# EAGLE design easy_001 (EAGLE 6.1)
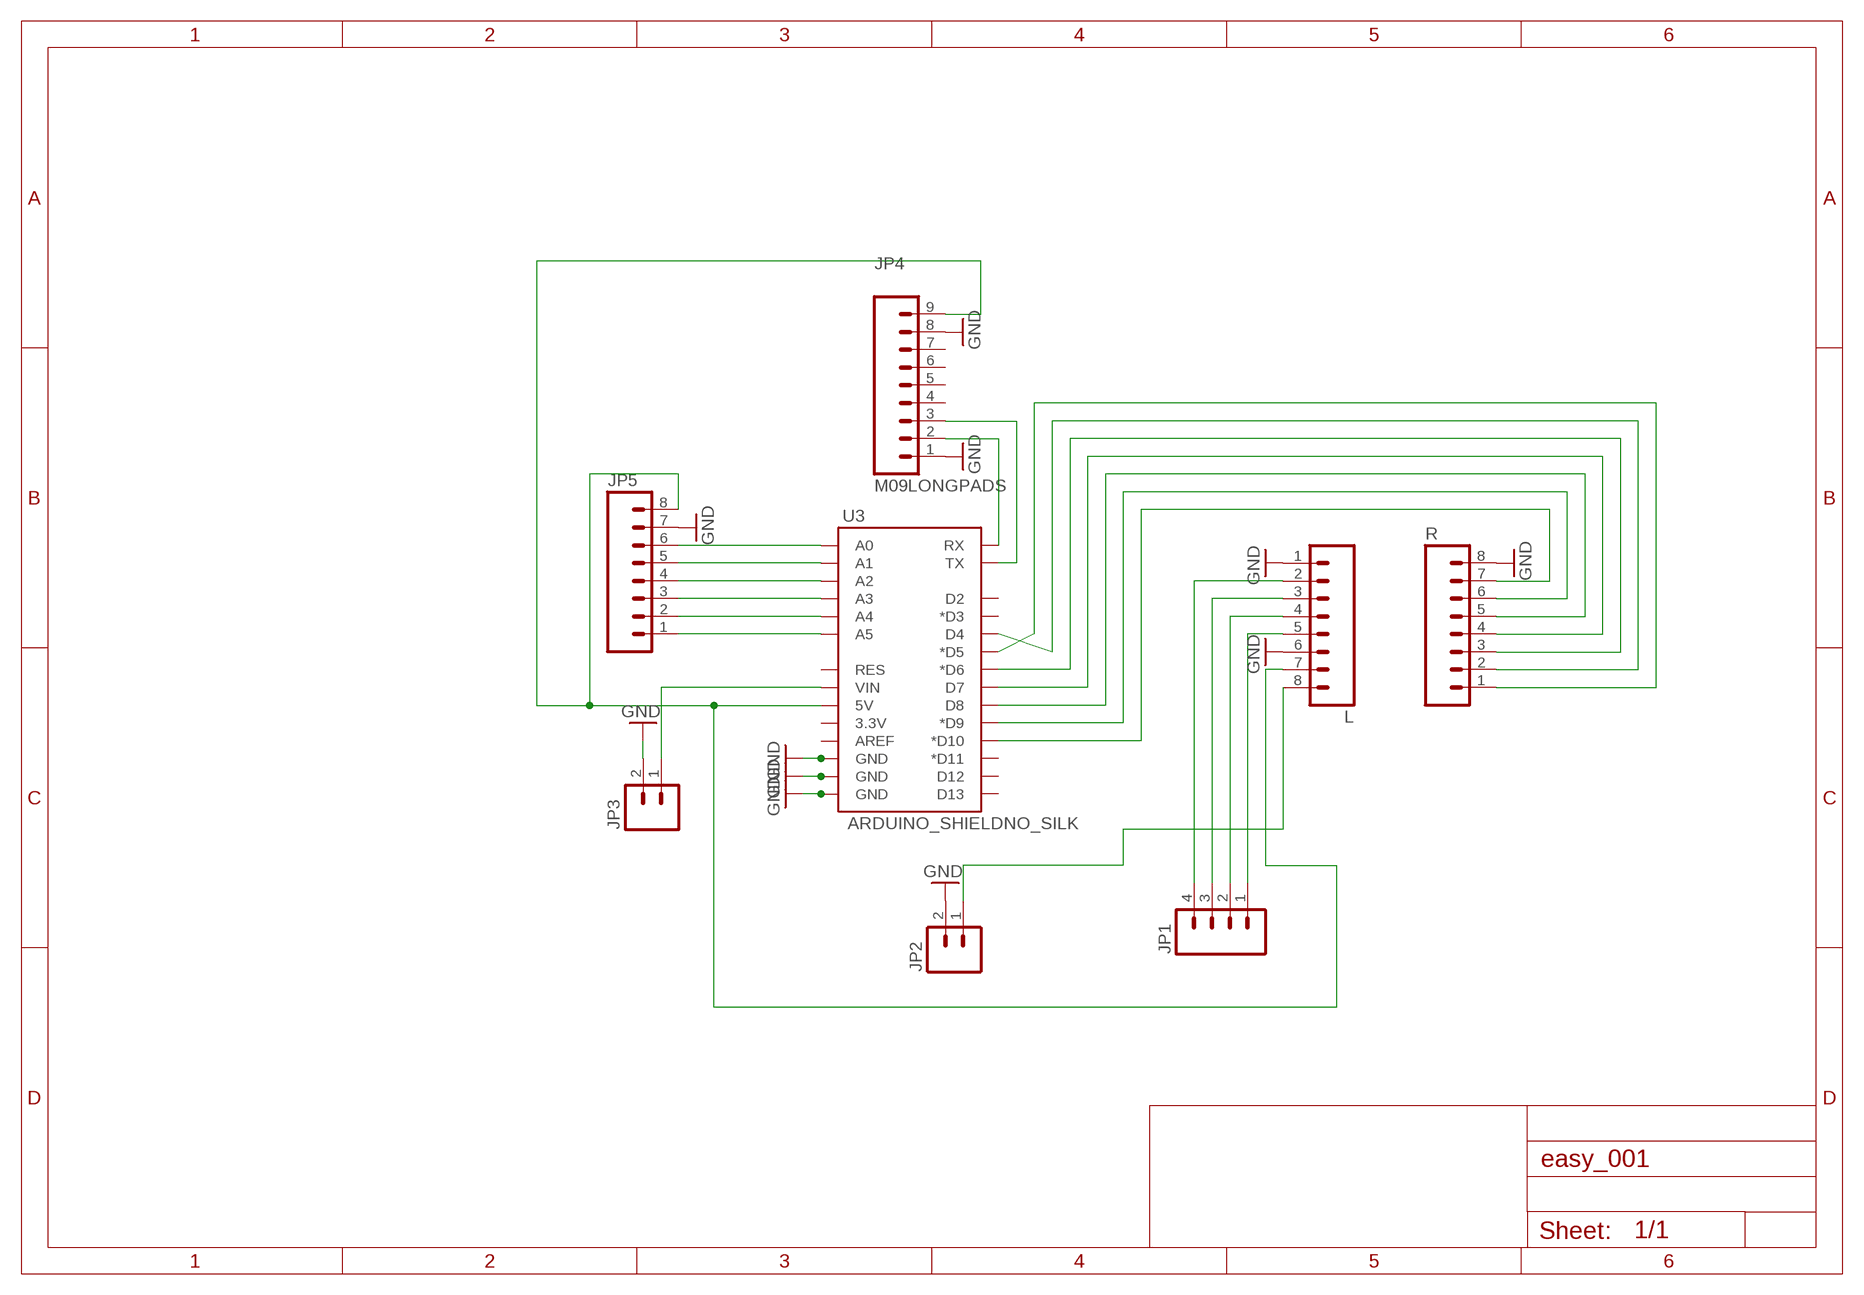
[diagram p0: schematic, sheet 1]

## Parts
JP1  M04LONGPADS  [1X04_LONGPADS]
JP2  M02PTH3  [1X02_LONGPADS]
JP3  M02PTH3  [1X02_LONGPADS]
JP4  M09LONGPADS  [1X09_LONGPADS]
JP5  M08LONGPADS  [1X08_LONGPADS]
L  M08LONGPADS  [1X08_LONGPADS]
R  M08LONGPADS  [1X08_LONGPADS]
U3  ARDUINO_SHIELDNO_SILK  [DUEMILANOVE_VIAS]

## Nets
GND: JP2.2 JP3.2 JP4.1 JP4.8 JP5.7 L.1 L.6 R.8 U3.GND@0(GND) U3.GND@1(GND) U3.GND@2(GND)
N$1: R.7 U3.D10(*D10)
N$2: R.6 U3.D9(*D9)
N$3: R.5 U3.D8
N$4: R.4 U3.D7
N$5: R.3 U3.D6(*D6)
N$6: R.2 U3.D4
N$7: R.1 U3.D5(*D5)
N$8: JP1.4 L.2
N$9: JP1.3 L.3
N$10: JP1.2 L.4
N$11: JP1.1 L.5
N$12: JP4.9 JP5.8 L.7 U3.5V
N$13: JP2.1 L.8
N$14: JP5.1 U3.A5
N$15: JP5.2 U3.A4
N$16: JP5.3 U3.A3
N$17: JP5.4 U3.A2
N$18: JP5.5 U3.A1
N$19: JP5.6 U3.A0
N$20: JP3.1 U3.VIN
N$21: JP4.2 U3.RX
N$22: JP4.3 U3.TX
Unconnected: JP4.4 JP4.5 JP4.6 JP4.7 U3.3.3V U3.AREF U3.D2 U3.D3(*D3) U3.D11(*D11) U3.D12 U3.D13 U3.RES

## Library data of the parts
JP1 = SparkFun-Connectors:M04: Header 4 Standard 4-pin 0.1" header. Use with straight break away headers (SKU : PRT-00116), right angle break away headers (PRT-00553), swiss pins (PRT-00743), machine pins (PRT-00117), and female headers (PRT-00115). Molex polarized connector foot print use with SKU : PRT-08231 with associated crimp pins and housings. 1MM SMD Version SKU: PRT-10208
JP2 JP3 = SparkFun-Connectors:M02: Header 2 Standard 2-pin 0.1" header. Use with straight break away headers (SKU : PRT-00116), right angle break away headers (PRT-00553), swiss pins (PRT-00743), machine pins (PRT-00117), and female headers (PRT-00115). Molex polarized connector foot print use with SKU : PRT-08233 with associated crimp pins and housings.
JP4 = SparkFun-Connectors:M09: Header 9 Standard 9-pin 0.1" header. Use with straight break away headers (SKU : PRT-00116), right angle break away headers (PRT-00553), swiss pins (PRT-00743), machine pins (PRT-00117), and female headers (PRT-00115).
JP5 = SparkFun-Connectors:M08: Header 8 Standard 8-pin 0.1" header. Use with straight break away headers (SKU : PRT-00116), right angle break away headers (PRT-00553), swiss pins (PRT-00743), machine pins (PRT-00117), and female headers (PRT-00115).
L R = SparkFun:M08: Header 8 Standard 8-pin 0.1" header. Use with straight break away headers (SKU : PRT-00116), right angle break away headers (PRT-00553), swiss pins (PRT-00743), machine pins (PRT-00117), and female headers (PRT-00115).
U3 = SparkFun-Boards:ARDUINO_SHIELD: Arduino shield footprint

## Board
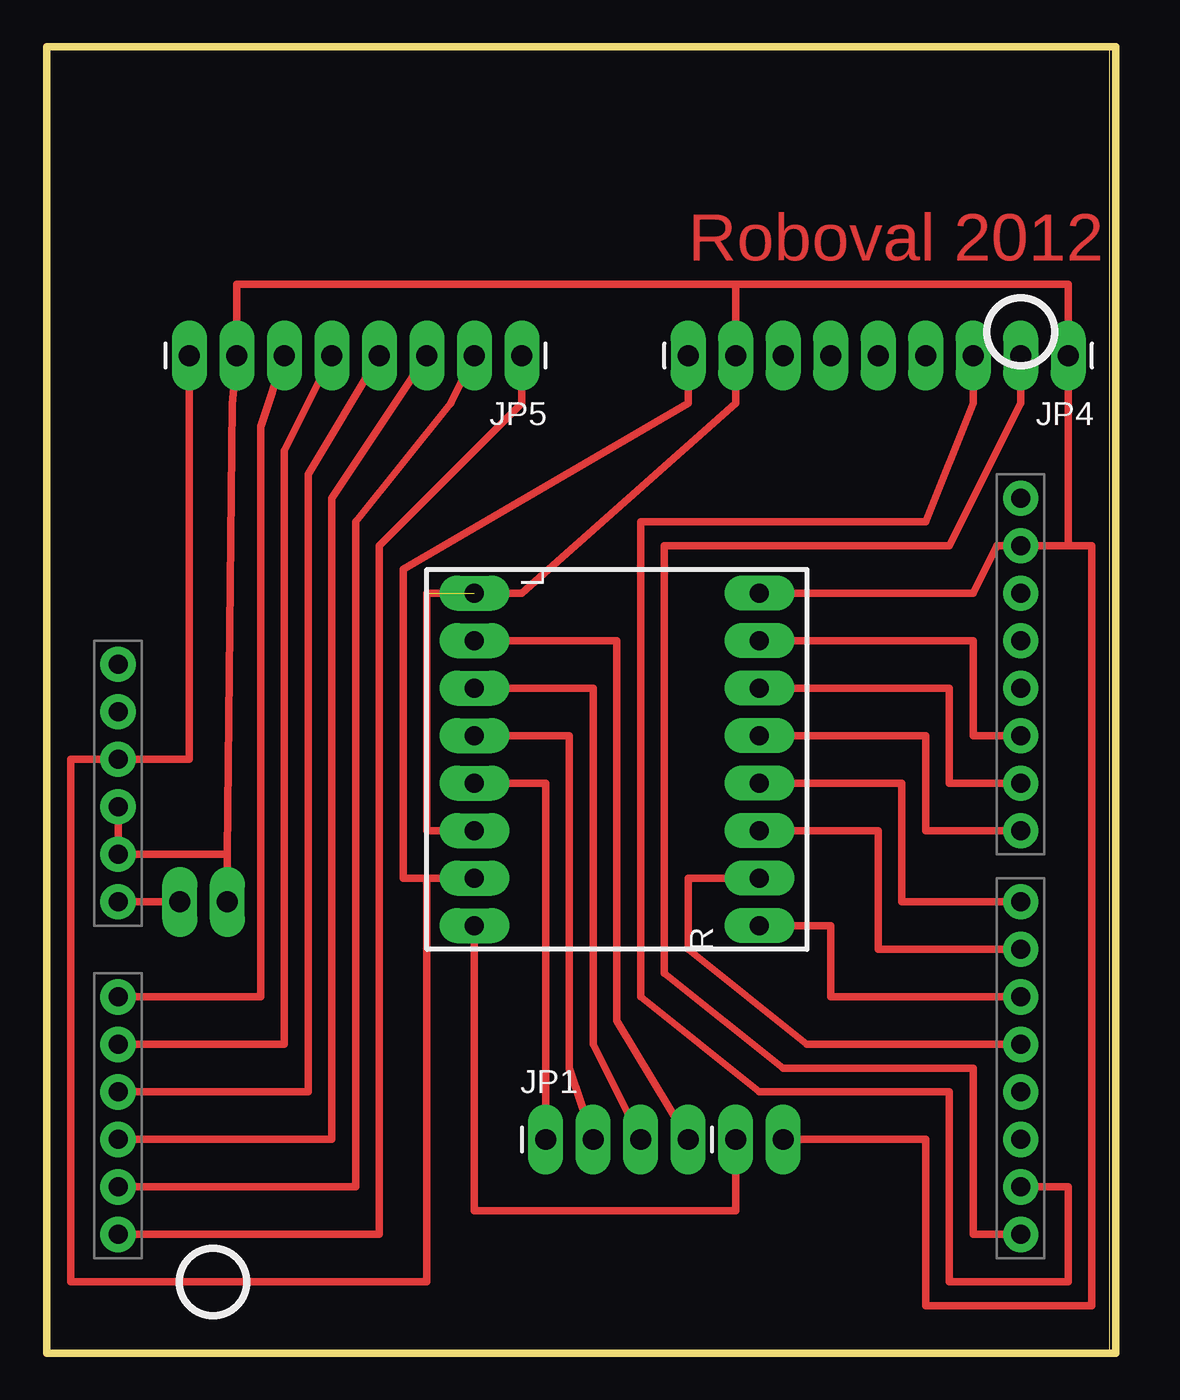
[diagram p1: board, top side]

Size 57.15 x 69.85 mm. Coordinates in mm from the lower left corner, seen from the top.
Outline: 56.82,0 56.82,69.84 0,69.84
Outline: 0,69.84 0,69.85 57.15,69.85 57.15,0 56.82,0
Outline: 0,69.84 0,0 56.82,0
Copper layers (1*16): Top 0.035mm / dielectric 1.5mm / Bottom 0.035mm
Design rules: minimum track width 10mil, minimum drill 1mm, track to track 8mil, track to pad 8mil, pad to pad 8mil, via to via 8mil, smd to smd 8mil, copper to edge 8mil, drill to drill 8mil, minimum pad ring 10mil, minimum via ring 8mil, stop-mask expansion 4mil, vias tented up to drill 0mil, thermal gap 10mil

### Footprints (pad centres in the part's own frame; a part is rotated, then mirrored left to right if it is on the bottom)
1X04_LONGPADS = drill 1.118 pad 1.88 long: 1 0,0; 2 2.54,0; 3 5.08,0; 4 7.62,0
1X02_LONGPADS = drill 1.118 pad 1.88 long: 1 0,0; 2 2.54,0
1X09_LONGPADS = drill 1.118 pad 1.88 long: 1 0,0; 2 2.54,0; 3 5.08,0; 4 7.62,0; 5 10.16,0; 6 12.7,0; 7 15.24,0; 8 17.78,0; 9 20.32,0
1X08_LONGPADS = drill 1.118 pad 1.88 long: 1 0,0; 2 2.54,0; 3 5.08,0; 4 7.62,0; 5 10.16,0; 6 12.7,0; 7 15.24,0; 8 17.78,0
1X08_LONGPADS' = drill 1.016 pad 1.88 long: 1 0,0; 2 2.54,0; 3 5.08,0; 4 7.62,0; 5 10.16,0; 6 12.7,0; 7 15.24,0; 8 17.78,0
DUEMILANOVE_VIAS = drill 1.016 pad 1.88: 3.3V 50.8,13.97; 5V 50.8,16.51; A0 50.8,29.21; A1 50.8,31.75; A2 50.8,34.29; A3 50.8,36.83; A4 50.8,39.37; A5 50.8,41.91; AREF 2.54,2.54; D2 2.54,36.83; D3 2.54,34.29; D4 2.54,31.75; D5 2.54,29.21; D6 2.54,26.67; D7 2.54,24.13; D8 2.54,20.32; D9 2.54,17.78; D10 2.54,15.24; D11 2.54,12.7; D12 2.54,10.16; D13 2.54,7.62; GND@0 50.8,19.05; GND@1 50.8,21.59; GND@2 2.54,5.08; RES 50.8,11.43; RX 2.54,41.91; TX 2.54,39.37; VIN 50.8,24.13

### Placement (x,y rotation side)
JP1  26.67,11.43 0 top
JP2  36.83,11.43 0 top
JP3  7.12,24.13 0 top
JP4  54.61,53.34 180 top
JP5  25.4,53.34 180 top
L  [1X08_LONGPADS']  22.86,40.64 270 top
R  [1X08_LONGPADS']  38.1,22.86 90 top
U3  54.61,48.26 180 top

### Tracks (layer width: path | path; a pad name or v marks a point on that pad's centre or on a via)
GND  (1 unrouted)
  Top 0.406: R.8 49.53,40.64 50.8,43.18 U3.GND@2 54.61,43.18 | L.6 20.32,27.94 20.32,40.64 25.4,40.64 36.83,50.8 JP4.8 36.83,57.15 | U3.GND@0 U3.GND@1 9.66,26.67 | JP2.2 46.99,11.43 46.99,2.54 55.88,2.54 55.88,43.18 54.61,43.18 | 54.61,43.18 JP4.1 54.61,57.15 36.83,57.15 | 36.83,57.15 10.16,57.15 JP5.7 9.91,50.73 9.66,26.67 | 9.66,26.67 JP3.2
N$1
  Top 0.406: R.7 49.53,38.1 49.53,33.02 U3.D10
N$2
  Top 0.406: R.6 48.26,35.56 48.26,30.48 U3.D9
N$3
  Top 0.406: R.5 46.99,33.02 46.99,27.94 U3.D8
N$4
  Top 0.406: R.4 45.72,30.48 45.72,24.13 U3.D7
N$5
  Top 0.406: R.3 44.45,27.94 44.45,21.59 U3.D6
N$6
  Top 0.406: R.2 34.29,25.4 34.29,21.59 40.64,16.51 U3.D4
N$7
  Top 0.406: R.1 41.91,22.86 41.91,19.05 U3.D5
N$8
  Top 0.406: L.2 30.48,38.1 30.48,17.78 JP1.4
N$9
  Top 0.406: L.3 29.21,35.56 29.21,16.51 JP1.3
N$10
  Top 0.406: L.4 27.94,33.02 27.94,15.24 JP1.2
N$11
  Top 0.406: L.5 26.67,30.48 JP1.1
N$12
  Top 0.406: JP5.8 7.62,31.75 U3.5V 1.27,31.75 1.27,3.81 20.32,3.81 20.32,25.4 | L.7 20.32,25.4 | JP4.9 34.29,50.8 19.05,41.91 19.05,25.4 20.32,25.4
N$13
  Top 0.406: JP2.1 36.83,7.62 22.86,7.62 L.8
N$14
  Top 0.406: JP5.1 25.4,50.8 17.78,43.18 17.78,6.35 U3.A5
N$15
  Top 0.406: JP5.2 21.59,50.8 16.51,44.45 16.51,8.89 U3.A4
N$16
  Top 0.406: JP5.3 15.24,45.72 15.24,11.43 U3.A3
N$17
  Top 0.406: JP5.4 13.97,46.99 13.97,13.97 U3.A2
N$18
  Top 0.406: JP5.5 12.7,48.26 12.7,16.51 U3.A1
N$19
  Top 0.406: JP5.6 11.43,49.53 11.43,19.05 U3.A0
N$20
  Top 0.406: U3.VIN JP3.1
N$21
  Top 0.406: U3.RX 49.53,6.35 49.53,15.24 39.37,15.24 33.02,20.32 33.02,43.18 48.26,43.18 52.07,50.8 JP4.2
N$22
  Top 0.406: U3.TX 54.61,8.89 54.61,3.81 48.26,3.81 48.26,13.97 38.1,13.97 31.75,19.05 31.75,44.45 46.99,44.45 49.53,50.8 JP4.3

### Text on the board
Top: Roboval 2012
Document: rx | tx | + | - | + | - | + | - | + | -